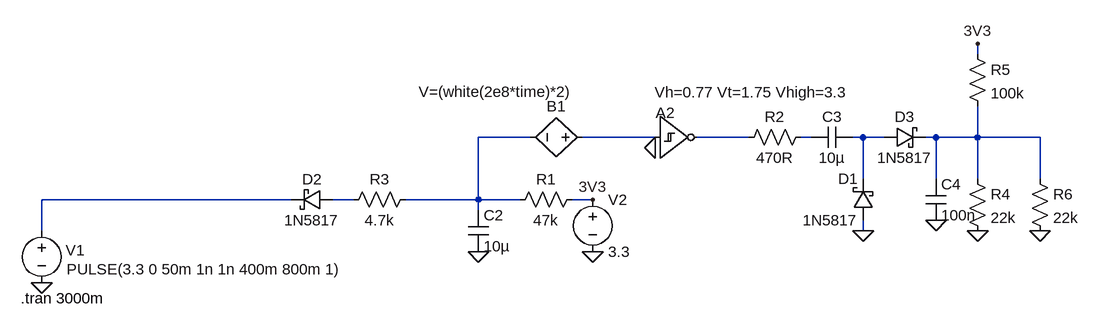
[diagram p0: schematic sim_DCDC_Power-Cycle.asc]
sim_DCDC_Power-Cycle.asc, the LTspice schematic file:
Version 4
SHEET 1 1688 680
WIRE 1472 -96 1472 -112
WIRE 784 32 704 32
WIRE 976 32 864 32
WIRE 1120 32 1040 32
WIRE 1216 32 1200 32
WIRE 1296 32 1280 32
WIRE 1328 32 1296 32
WIRE 1408 32 1392 32
WIRE 1472 32 1472 -16
WIRE 1472 32 1408 32
WIRE 1568 32 1472 32
WIRE 1296 96 1296 32
WIRE 1408 96 1408 32
WIRE 1472 96 1472 32
WIRE 1568 96 1568 32
WIRE 416 128 32 128
WIRE 512 128 480 128
WIRE 704 128 704 32
WIRE 704 128 592 128
WIRE 768 128 704 128
WIRE 880 128 848 128
WIRE 704 144 704 128
WIRE 32 176 32 128
WIRE 1296 176 1296 160
FLAG 32 256 0
FLAG 704 208 0
FLAG 880 208 0
FLAG 880 128 3V3
FLAG 1296 176 0
FLAG 1408 160 0
FLAG 1472 176 0
FLAG 1472 -112 3V3
FLAG 976 48 0
FLAG 1568 176 0
SYMBOL voltage 32 160 R0
WINDOW 0 37 46 Left 2
WINDOW 3 39 75 Left 2
WINDOW 123 0 0 Left 2
WINDOW 39 0 0 Left 2
SYMATTR InstName V1
SYMATTR Value PULSE(3.3 0 50m 1n 1n 400m 800m 1)
SYMBOL voltage 880 112 R0
WINDOW 123 0 0 Left 2
WINDOW 39 0 0 Left 2
SYMATTR InstName V2
SYMATTR Value 3.3
SYMBOL cap 688 144 R0
SYMATTR InstName C2
SYMATTR Value 10µ
SYMBOL res 864 112 R90
WINDOW 0 0 56 VBottom 2
WINDOW 3 32 56 VTop 2
SYMATTR InstName R1
SYMATTR Value 47k
SYMBOL res 608 112 R90
WINDOW 0 0 56 VBottom 2
WINDOW 3 32 56 VTop 2
SYMATTR InstName R3
SYMATTR Value 4.7k
SYMBOL schottky 480 112 R90
WINDOW 0 0 32 VBottom 2
WINDOW 3 32 32 VTop 2
SYMATTR InstName D2
SYMATTR Value 1N5817
SYMATTR Description Diode
SYMATTR Type diode
SYMBOL cap 1280 16 R90
WINDOW 0 0 32 VBottom 2
WINDOW 3 32 32 VTop 2
SYMATTR InstName C3
SYMATTR Value 10µ
SYMBOL schottky 1312 160 R180
WINDOW 0 24 64 Left 2
WINDOW 3 24 0 Left 2
SYMATTR InstName D1
SYMATTR Value 1N5817
SYMATTR Description Diode
SYMATTR Type diode
SYMBOL schottky 1328 48 R270
WINDOW 0 32 32 VTop 2
WINDOW 3 0 32 VBottom 2
SYMATTR InstName D3
SYMATTR Value 1N5817
SYMATTR Description Diode
SYMATTR Type diode
SYMBOL res 1216 16 R90
WINDOW 0 0 56 VBottom 2
WINDOW 3 32 56 VTop 2
SYMATTR InstName R2
SYMATTR Value 470R
SYMBOL cap 1392 96 R0
SYMATTR InstName C4
SYMATTR Value 100n
SYMBOL res 1456 80 R0
SYMATTR InstName R4
SYMATTR Value 22k
SYMBOL res 1456 -112 R0
SYMATTR InstName R5
SYMATTR Value 100k
SYMBOL Digital\\schmtinv 976 -32 R0
WINDOW 3 -1 -5 Left 2
WINDOW 0 1 26 Left 2
SYMATTR Value Vh=0.77 Vt=1.75 Vhigh=3.3
SYMATTR InstName A2
SYMBOL bv 880 32 R90
WINDOW 0 -32 56 VBottom 2
WINDOW 3 -86 149 VTop 2
SYMATTR InstName B1
SYMATTR Value V=(white(2e8*time)*2)
SYMBOL res 1552 80 R0
SYMATTR InstName R6
SYMATTR Value 22k
TEXT 0 280 Left 2 !.tran 3000m

The netlist it stands for:
* sim_DCDC_Power-Cycle.asc
V1 N007 0 PULSE(3.3 0 50m 1n 1n 400m 800m 1)
V2 3V3 0 3.3
C2 N001 0 10µ
R1 3V3 N001 47k
R3 N001 N008 4.7k
D2 N008 N007 1N5817
C3 N005 N004 10µ
D1 0 N005 1N5817
D3 N005 N006 1N5817
R2 N004 N003 470R
C4 N006 0 100n
R4 N006 0 22k
R5 3V3 N006 100k
A2 N002 0 0 0 0 N003 0 0 SCHMITT Vh=0.77 Vt=1.75 Vhigh=3.3
B1 N002 N001 V=(white(2e8*time)*2)
R6 N006 0 22k
.model D D
.lib standard.dio
.tran 3000m
.backanno
.end